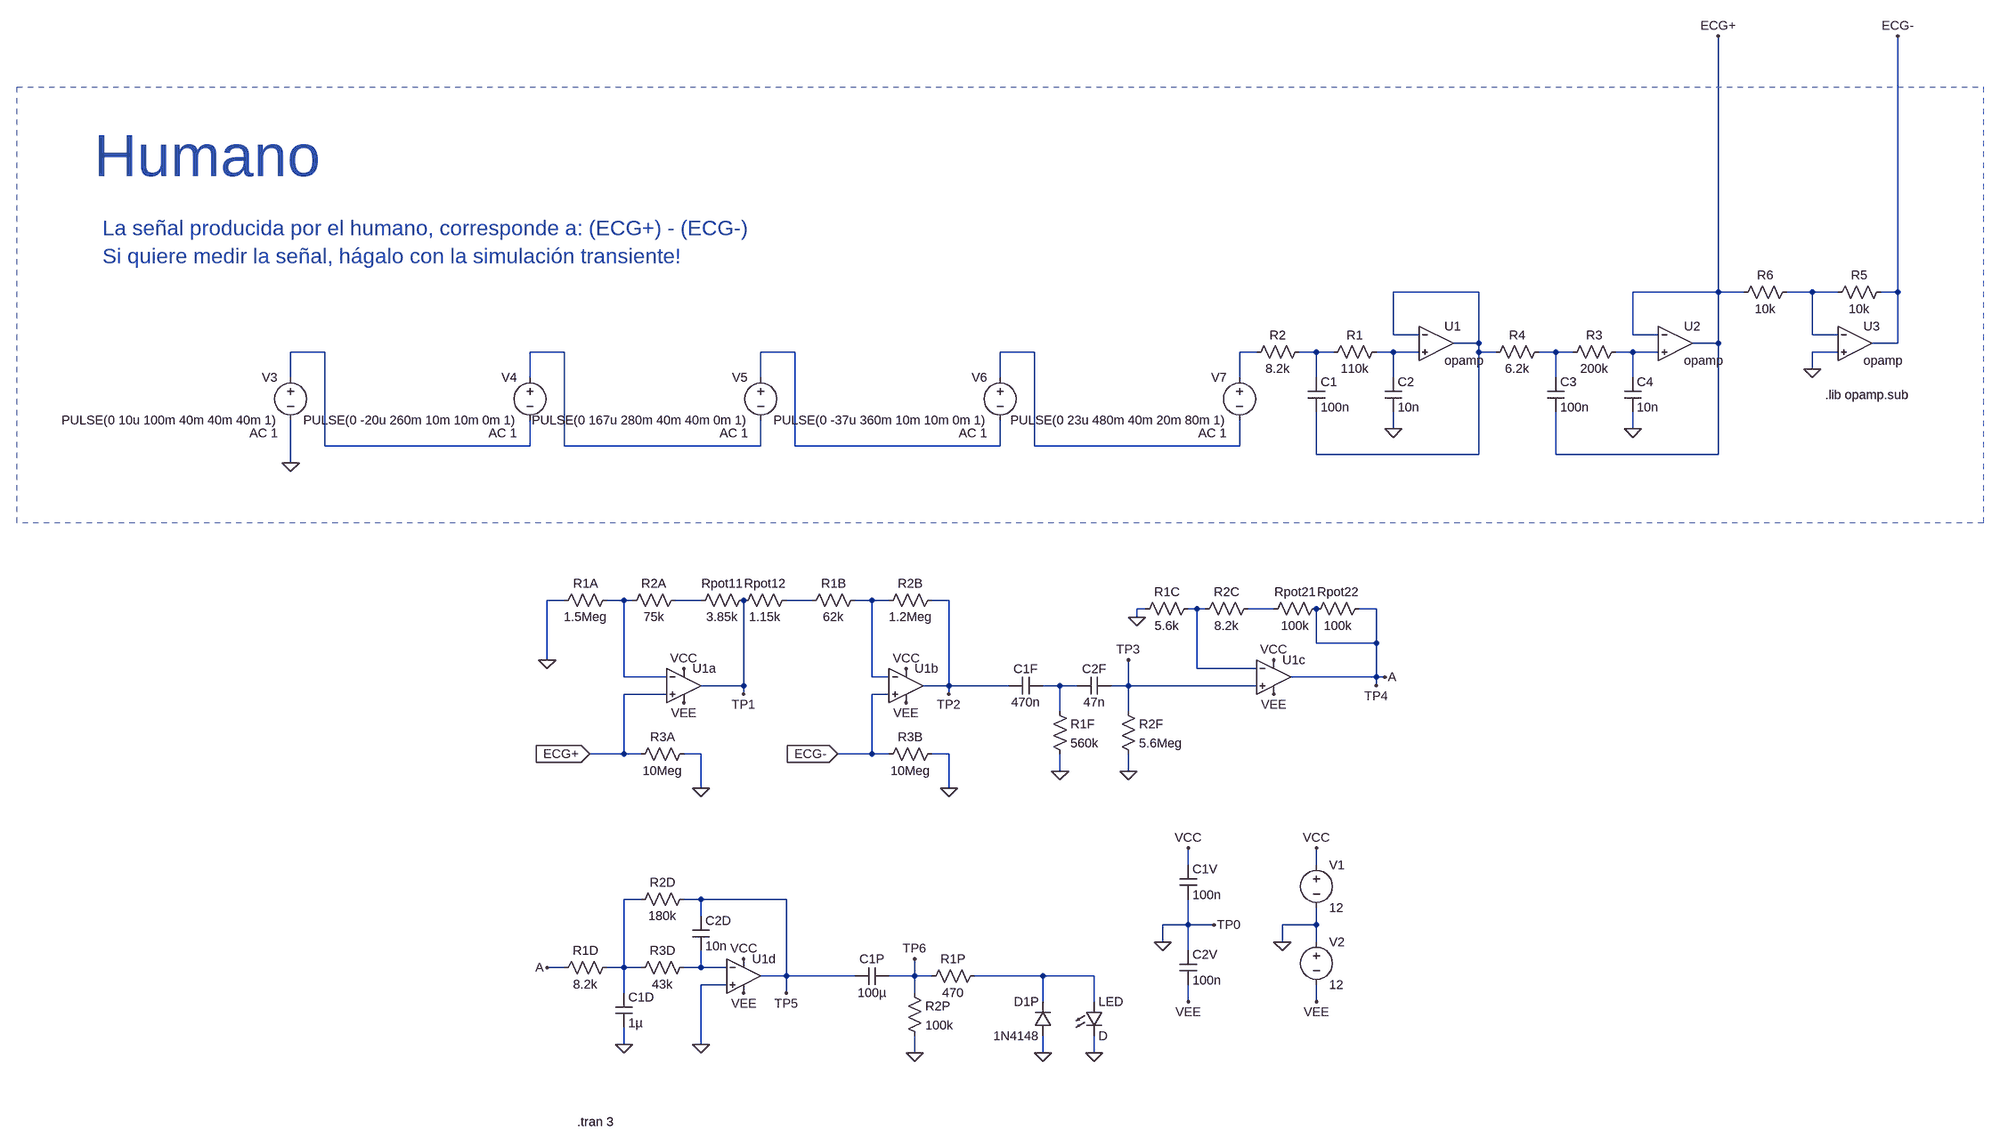
[diagram p0: schematic CircuitoProyecto.asc]
CircuitoProyecto.asc, the LTspice schematic file:
Version 4
SHEET 1 2628 1372
WIRE 1680 -496 1520 -496
WIRE 2128 -496 2128 -976
WIRE 2128 -496 1968 -496
WIRE 2176 -496 2128 -496
WIRE 2304 -496 2256 -496
WIRE 2352 -496 2304 -496
WIRE 2464 -496 2464 -976
WIRE 2464 -496 2432 -496
WIRE 1520 -416 1520 -496
WIRE 1568 -416 1520 -416
WIRE 1968 -416 1968 -496
WIRE 2016 -416 1968 -416
WIRE 2304 -416 2304 -496
WIRE 2352 -416 2304 -416
WIRE 1680 -400 1680 -496
WIRE 1680 -400 1632 -400
WIRE 2128 -400 2128 -496
WIRE 2128 -400 2080 -400
WIRE 2464 -400 2464 -496
WIRE 2464 -400 2416 -400
WIRE -480 -384 -544 -384
WIRE -32 -384 -96 -384
WIRE 400 -384 336 -384
WIRE 848 -384 784 -384
WIRE 1264 -384 1232 -384
WIRE 1376 -384 1344 -384
WIRE 1408 -384 1376 -384
WIRE 1520 -384 1488 -384
WIRE 1568 -384 1520 -384
WIRE 1680 -384 1680 -400
WIRE 1712 -384 1680 -384
WIRE 1824 -384 1792 -384
WIRE 1856 -384 1824 -384
WIRE 1968 -384 1936 -384
WIRE 2016 -384 1968 -384
WIRE 2352 -384 2304 -384
WIRE 2304 -352 2304 -384
WIRE -544 -336 -544 -384
WIRE -96 -336 -96 -384
WIRE 336 -336 336 -384
WIRE 784 -336 784 -384
WIRE 1232 -336 1232 -384
WIRE 1376 -336 1376 -384
WIRE 1520 -336 1520 -384
WIRE 1824 -336 1824 -384
WIRE 1968 -336 1968 -384
WIRE 1520 -240 1520 -272
WIRE 1968 -240 1968 -272
WIRE -480 -208 -480 -384
WIRE -96 -208 -96 -256
WIRE -96 -208 -480 -208
WIRE -32 -208 -32 -384
WIRE 336 -208 336 -256
WIRE 336 -208 -32 -208
WIRE 400 -208 400 -384
WIRE 784 -208 784 -256
WIRE 784 -208 400 -208
WIRE 848 -208 848 -384
WIRE 1232 -208 1232 -256
WIRE 1232 -208 848 -208
WIRE 1376 -192 1376 -272
WIRE 1680 -192 1680 -384
WIRE 1680 -192 1376 -192
WIRE 1824 -192 1824 -272
WIRE 2128 -192 2128 -400
WIRE 2128 -192 1824 -192
WIRE -544 -176 -544 -256
WIRE -32 96 -64 96
WIRE 80 96 48 96
WIRE 96 96 80 96
WIRE 224 96 176 96
WIRE 432 96 384 96
WIRE 544 96 512 96
WIRE 576 96 544 96
WIRE 688 96 656 96
WIRE 1056 112 1040 112
WIRE 1152 112 1136 112
WIRE 1168 112 1152 112
WIRE 1296 112 1248 112
WIRE 1488 112 1456 112
WIRE 1040 128 1040 112
WIRE 1376 176 1376 112
WIRE 1488 176 1488 112
WIRE 1488 176 1376 176
WIRE -64 208 -64 96
WIRE 1152 224 1152 112
WIRE 1264 224 1152 224
WIRE 80 240 80 96
WIRE 160 240 80 240
WIRE 544 240 544 96
WIRE 576 240 544 240
WIRE 1488 240 1488 176
WIRE 1488 240 1328 240
WIRE 1504 240 1488 240
WIRE 304 256 304 96
WIRE 304 256 224 256
WIRE 688 256 688 96
WIRE 688 256 640 256
WIRE 800 256 688 256
WIRE 896 256 864 256
WIRE 928 256 896 256
WIRE 1024 256 1024 208
WIRE 1024 256 992 256
WIRE 1264 256 1024 256
WIRE 1488 256 1488 240
WIRE 160 272 80 272
WIRE 304 272 304 256
WIRE 576 272 544 272
WIRE 688 272 688 256
WIRE 896 304 896 256
WIRE 1024 304 1024 256
WIRE 80 384 80 272
WIRE 80 384 16 384
WIRE 112 384 80 384
WIRE 224 384 192 384
WIRE 544 384 544 272
WIRE 544 384 480 384
WIRE 576 384 544 384
WIRE 688 384 656 384
WIRE 896 416 896 384
WIRE 1024 416 1024 384
WIRE 224 448 224 384
WIRE 688 448 688 384
WIRE 1136 592 1136 560
WIRE 1376 592 1376 560
WIRE 112 656 80 656
WIRE 224 656 192 656
WIRE 384 656 224 656
WIRE 224 688 224 656
WIRE 1136 704 1136 656
WIRE 1136 704 1088 704
WIRE 1184 704 1136 704
WIRE 1376 704 1376 672
WIRE 1376 704 1312 704
WIRE 1088 736 1088 704
WIRE 1312 736 1312 704
WIRE 1376 736 1376 704
WIRE 1136 752 1136 704
WIRE -32 784 -64 784
WIRE 80 784 80 656
WIRE 80 784 48 784
WIRE 112 784 80 784
WIRE 224 784 224 752
WIRE 224 784 192 784
WIRE 272 784 224 784
WIRE 384 800 384 656
WIRE 384 800 336 800
WIRE 512 800 384 800
WIRE 624 800 624 768
WIRE 624 800 576 800
WIRE 656 800 624 800
WIRE 864 800 736 800
WIRE 960 800 864 800
WIRE 272 816 224 816
WIRE 80 832 80 784
WIRE 384 832 384 800
WIRE 624 832 624 800
WIRE 864 848 864 800
WIRE 960 848 960 800
WIRE 1136 848 1136 816
WIRE 1376 848 1376 816
WIRE 80 928 80 896
WIRE 224 928 224 816
WIRE 624 944 624 912
WIRE 864 944 864 912
WIRE 960 944 960 912
FLAG -64 208 0
FLAG 192 224 VCC
FLAG 192 288 VEE
FLAG 608 224 VCC
FLAG 608 288 VEE
FLAG 224 448 0
FLAG 16 384 ECG+
IOPIN 16 384 In
FLAG 688 448 0
FLAG 480 384 ECG-
IOPIN 480 384 In
FLAG 304 272 TP1
FLAG 688 272 TP2
FLAG 896 416 0
FLAG 1024 416 0
FLAG 1024 208 TP3
FLAG 1504 240 A
FLAG 1488 256 TP4
FLAG 1296 208 VCC
FLAG 1296 272 VEE
FLAG 80 928 0
FLAG -64 784 A
FLAG 304 768 VCC
FLAG 304 832 VEE
FLAG 224 928 0
FLAG 384 832 TP5
FLAG 624 768 TP6
FLAG 624 944 0
FLAG 864 944 0
FLAG 960 944 0
FLAG 1088 736 0
FLAG 1136 560 VCC
FLAG 1136 848 VEE
FLAG 1184 704 TP0
FLAG 1040 128 0
FLAG 1312 736 0
FLAG 1376 560 VCC
FLAG 1376 848 VEE
FLAG -544 -176 0
FLAG 1520 -240 0
FLAG 1968 -240 0
FLAG 2304 -352 0
FLAG 2128 -976 ECG+
FLAG 2464 -976 ECG-
SYMBOL res 64 80 R90
WINDOW 0 0 56 VBottom 2
WINDOW 3 32 56 VTop 2
SYMATTR InstName R1A
SYMATTR Value 1.5Meg
SYMBOL res 192 80 R90
WINDOW 0 0 56 VBottom 2
WINDOW 3 32 56 VTop 2
SYMATTR InstName R2A
SYMATTR Value 75k
SYMBOL res 320 80 R90
WINDOW 0 0 56 VBottom 2
WINDOW 3 32 56 VTop 2
SYMATTR InstName Rpot11
SYMATTR Value 3.85k
SYMBOL res 400 80 R90
WINDOW 0 0 56 VBottom 2
WINDOW 3 32 56 VTop 2
SYMATTR InstName Rpot12
SYMATTR Value 1.15k
SYMBOL res 528 80 R90
WINDOW 0 0 56 VBottom 2
WINDOW 3 32 56 VTop 2
SYMATTR InstName R1B
SYMATTR Value 62k
SYMBOL res 672 80 R90
WINDOW 0 0 56 VBottom 2
WINDOW 3 32 56 VTop 2
SYMATTR InstName R2B
SYMATTR Value 1.2Meg
SYMBOL OpAmps\\UniversalOpamp2 192 256 R0
SYMATTR InstName U1a
SYMBOL OpAmps\\UniversalOpamp2 608 256 R0
SYMATTR InstName U1b
SYMBOL res 208 368 R90
WINDOW 0 0 56 VBottom 2
WINDOW 3 32 56 VTop 2
SYMATTR InstName R3A
SYMATTR Value 10Meg
SYMBOL res 672 368 R90
WINDOW 0 0 56 VBottom 2
WINDOW 3 32 56 VTop 2
SYMATTR InstName R3B
SYMATTR Value 10Meg
SYMBOL cap 864 240 R90
WINDOW 0 0 32 VBottom 2
WINDOW 3 32 32 VTop 2
SYMATTR InstName C1F
SYMATTR Value 470n
SYMBOL cap 992 240 R90
WINDOW 0 0 32 VBottom 2
WINDOW 3 32 32 VTop 2
SYMATTR InstName C2F
SYMATTR Value 47n
SYMBOL res 880 288 R0
SYMATTR InstName R1F
SYMATTR Value 560k
SYMBOL res 1008 288 R0
SYMATTR InstName R2F
SYMATTR Value 5.6Meg
SYMBOL OpAmps\\UniversalOpamp2 1296 240 R0
SYMATTR InstName U1c
SYMBOL res 1152 96 R90
WINDOW 0 0 56 VBottom 2
WINDOW 3 32 56 VTop 2
SYMATTR InstName R1C
SYMATTR Value 5.6k
SYMBOL res 1264 96 R90
WINDOW 0 0 56 VBottom 2
WINDOW 3 32 56 VTop 2
SYMATTR InstName R2C
SYMATTR Value 8.2k
SYMBOL res 1392 96 R90
WINDOW 0 0 56 VBottom 2
WINDOW 3 32 56 VTop 2
SYMATTR InstName Rpot21
SYMATTR Value 100k
SYMBOL res 1472 96 R90
WINDOW 0 0 56 VBottom 2
WINDOW 3 32 56 VTop 2
SYMATTR InstName Rpot22
SYMATTR Value 100k
SYMBOL res 64 768 R90
WINDOW 0 0 56 VBottom 2
WINDOW 3 32 56 VTop 2
SYMATTR InstName R1D
SYMATTR Value 8.2k
SYMBOL res 208 768 R90
WINDOW 0 0 56 VBottom 2
WINDOW 3 32 56 VTop 2
SYMATTR InstName R3D
SYMATTR Value 43k
SYMBOL res 208 640 R90
WINDOW 0 0 56 VBottom 2
WINDOW 3 32 56 VTop 2
SYMATTR InstName R2D
SYMATTR Value 180k
SYMBOL cap 64 832 R0
SYMATTR InstName C1D
SYMATTR Value 1µ
SYMBOL cap 208 688 R0
SYMATTR InstName C2D
SYMATTR Value 10n
SYMBOL OpAmps\\UniversalOpamp2 304 800 R0
SYMATTR InstName U1d
SYMBOL cap 576 784 R90
WINDOW 0 0 32 VBottom 2
WINDOW 3 32 32 VTop 2
SYMATTR InstName C1P
SYMATTR Value 100µ
SYMBOL res 608 816 R0
SYMATTR InstName R2P
SYMATTR Value 100k
SYMBOL res 752 784 R90
WINDOW 0 0 56 VBottom 2
WINDOW 3 32 56 VTop 2
SYMATTR InstName R1P
SYMATTR Value 470
SYMBOL diode 880 912 R180
WINDOW 0 24 64 Left 2
WINDOW 3 24 0 Left 2
SYMATTR InstName D1P
SYMATTR Value 1N4148
SYMBOL cap 1120 592 R0
SYMATTR InstName C1V
SYMATTR Value 100n
SYMBOL cap 1120 752 R0
SYMATTR InstName C2V
SYMATTR Value 100n
SYMBOL voltage 1376 576 R0
WINDOW 123 0 0 Left 0
WINDOW 39 0 0 Left 0
SYMATTR InstName V1
SYMATTR Value 12
SYMBOL voltage 1376 720 R0
WINDOW 123 0 0 Left 0
WINDOW 39 0 0 Left 0
SYMATTR InstName V2
SYMATTR Value 12
SYMBOL voltage -544 -352 M0
WINDOW 123 24 120 Left 2
WINDOW 39 0 0 Left 0
SYMATTR Value2 AC 1
SYMATTR InstName V3
SYMATTR Value PULSE(0 10u 100m 40m 40m 40m 1)
SYMBOL voltage -96 -352 M0
WINDOW 123 24 120 Left 2
WINDOW 39 0 0 Left 0
SYMATTR Value2 AC 1
SYMATTR InstName V4
SYMATTR Value PULSE(0 -20u 260m 10m 10m 0m 1)
SYMBOL voltage 336 -352 M0
WINDOW 123 24 120 Left 2
WINDOW 39 0 0 Left 0
SYMATTR Value2 AC 1
SYMATTR InstName V5
SYMATTR Value PULSE(0 167u 280m 40m 40m 0m 1)
SYMBOL voltage 784 -352 M0
WINDOW 123 24 120 Left 2
WINDOW 39 0 0 Left 0
SYMATTR Value2 AC 1
SYMATTR InstName V6
SYMATTR Value PULSE(0 -37u 360m 10m 10m 0m 1)
SYMBOL voltage 1232 -352 M0
WINDOW 123 24 120 Left 2
WINDOW 39 0 0 Left 0
SYMATTR Value2 AC 1
SYMATTR InstName V7
SYMATTR Value PULSE(0 23u 480m 40m 20m 80m 1)
SYMBOL cap 1360 -336 R0
SYMATTR InstName C1
SYMATTR Value 100n
SYMBOL cap 1504 -336 R0
SYMATTR InstName C2
SYMATTR Value 10n
SYMBOL res 1504 -400 R90
WINDOW 0 0 56 VBottom 2
WINDOW 3 32 56 VTop 2
SYMATTR InstName R1
SYMATTR Value 110k
SYMBOL res 1360 -400 R90
WINDOW 0 0 56 VBottom 2
WINDOW 3 32 56 VTop 2
SYMATTR InstName R2
SYMATTR Value 8.2k
SYMBOL cap 1808 -336 R0
SYMATTR InstName C3
SYMATTR Value 100n
SYMBOL cap 1952 -336 R0
SYMATTR InstName C4
SYMATTR Value 10n
SYMBOL res 1952 -400 R90
WINDOW 0 0 56 VBottom 2
WINDOW 3 32 56 VTop 2
SYMATTR InstName R3
SYMATTR Value 200k
SYMBOL res 1808 -400 R90
WINDOW 0 0 56 VBottom 2
WINDOW 3 32 56 VTop 2
SYMATTR InstName R4
SYMATTR Value 6.2k
SYMBOL Opamps\\opamp 1600 -464 R0
SYMATTR InstName U1
SYMBOL Opamps\\opamp 2048 -464 R0
SYMATTR InstName U2
SYMBOL Opamps\\opamp 2384 -464 R0
SYMATTR InstName U3
SYMBOL res 2448 -512 R90
WINDOW 0 0 56 VBottom 2
WINDOW 3 32 56 VTop 2
SYMATTR InstName R5
SYMATTR Value 10k
SYMBOL res 2272 -512 R90
WINDOW 0 0 56 VBottom 2
WINDOW 3 32 56 VTop 2
SYMATTR InstName R6
SYMATTR Value 10k
SYMBOL LED 944 848 R0
SYMATTR InstName LED
TEXT 2328 -304 Left 2 !.lib opamp.sub
TEXT -912 -752 Left 7 ;Humano
TEXT -896 -616 Left 4 ;La señal producida por el humano, corresponde a: (ECG+) - (ECG-)\nSi quiere medir la señal, hágalo con la simulación transiente!
TEXT -8 1088 Left 2 !.tran 3
RECTANGLE Normal 2624 -64 -1056 -880 2

The netlist it stands for:
* CircuitoProyecto.asc
R1A N012 0 1.5Meg
R2A N013 N012 75k
Rpot11 TP1 N013 3.85k
Rpot12 N014 TP1 1.15k
R1B N015 N014 62k
R2B TP2 N015 1.2Meg
XU1a ECG+ N012 VCC VEE TP1 level.2 Avol=1Meg GBW=10Meg Slew=10Meg ilimit=25m rail=0 Vos=0 phimargin=45 en=0 enk=0 in=0 ink=0 Rin=500Meg  ; pins IN+ IN- V+ V- OUT
XU1b ECG- N015 VCC VEE TP2 level.2 Avol=1Meg GBW=10Meg Slew=10Meg ilimit=25m rail=0 Vos=0 phimargin=45 en=0 enk=0 in=0 ink=0 Rin=500Meg  ; pins IN+ IN- V+ V- OUT
R3A 0 ECG+ 10Meg
R3B 0 ECG- 10Meg
C1F N018 TP2 470n
C2F TP3 N018 47n
R1F N018 0 560k
R2F TP3 0 5.6Meg
XU1c TP3 N016 VCC VEE TP4 level.2 Avol=1Meg GBW=10Meg Slew=10Meg ilimit=25m rail=0 Vos=0 phimargin=45 en=0 enk=0 in=0 ink=0 Rin=500Meg  ; pins IN+ IN- V+ V- OUT
R1C N016 0 5.6k
R2C N017 N016 8.2k
Rpot21 TP4 N017 100k
Rpot22 TP4 TP4 100k
R1D N019 TP4 8.2k
R3D N020 N019 43k
R2D TP5 N019 180k
C1D N019 0 1µ
C2D TP5 N020 10n
XU1d 0 N020 VCC VEE TP5 level.2 Avol=1Meg GBW=10Meg Slew=10Meg ilimit=25m rail=0 Vos=0 phimargin=45 en=0 enk=0 in=0 ink=0 Rin=500Meg  ; pins IN+ IN- V+ V- OUT
C1P TP6 TP5 100µ
R2P TP6 0 100k
R1P N021 TP6 470
D1P 0 N021 1N4148
C1V VCC 0 100n
C2V 0 VEE 100n
V1 VCC 0 12
V2 0 VEE 12
V3 N003 0 PULSE(0 10u 100m 40m 40m 40m 1) AC 1
V4 N004 N003 PULSE(0 -20u 260m 10m 10m 0m 1) AC 1
V5 N005 N004 PULSE(0 167u 280m 40m 40m 0m 1) AC 1
V6 N006 N005 PULSE(0 -37u 360m 10m 10m 0m 1) AC 1
V7 N007 N006 PULSE(0 23u 480m 40m 20m 80m 1) AC 1
C1 N008 N001 100n
C2 N009 0 10n
R1 N009 N008 110k
R2 N008 N007 8.2k
C3 N010 ECG+ 100n
C4 N011 0 10n
R3 N011 N010 200k
R4 N010 N001 6.2k
XU1 N001 N009 N001 opamp Aol=100K GBW=10Meg  ; pins invin noninvin out
XU2 ECG+ N011 ECG+ opamp Aol=100K GBW=10Meg  ; pins invin noninvin out
XU3 N002 0 ECG- opamp Aol=100K GBW=10Meg  ; pins invin noninvin out
R5 ECG- N002 10k
R6 N002 ECG+ 10k
D§LED N021 0 D
.model D D
.lib standard.dio
.lib opamp.sub
* Humano
* La señal producida por el humano, corresponde a: (ECG+) - (ECG-)
* Si quiere medir la señal, hágalo con la simulación transiente!
.tran 3
.lib UniversalOpamps2.sub
.backanno
.end

* Results of the author's LTspice run, read from the files saved beside the schematic
* Operating Point, zero values left out:
*   V(vcc) = 12 V
*   V(vee) = -12 V
*   I(V2) = -4.797 mA
*   I(V1) = -4.797 mA
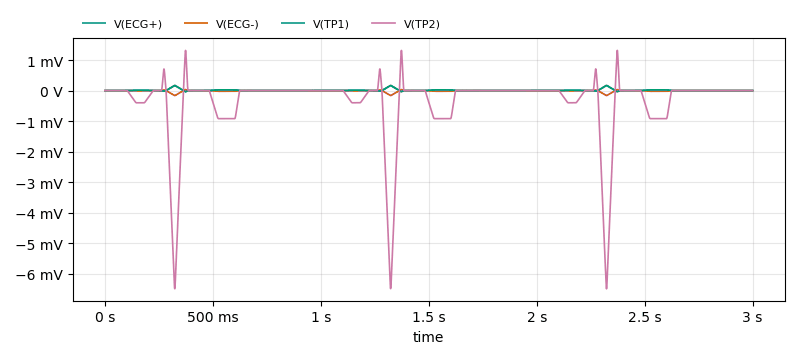
[diagram p1: Transient Analysis of CircuitoProyecto.asc, plotted from the saved traces]
* Transient Analysis, 1 run:
*   V(ECG+): min -32.98 µV, max 162.5 µV, average 9.44 µV, rms 28.52 µV, last 0 V
*   V(ECG-): min -162.5 µV, max 32.98 µV, average -9.44 µV, rms 28.52 µV, last 0 V
*   V(TP1): min -34.71 µV, max 171.1 µV, average 9.938 µV, rms 30.03 µV, last 0 V
*   V(TP2): min -6.502 mV, max 1.319 mV, average -377.7 µV, rms 1.141 mV, last 0 V